# Altium schematic sheet CAN_Module.SchDoc
size 297 x 209 mm
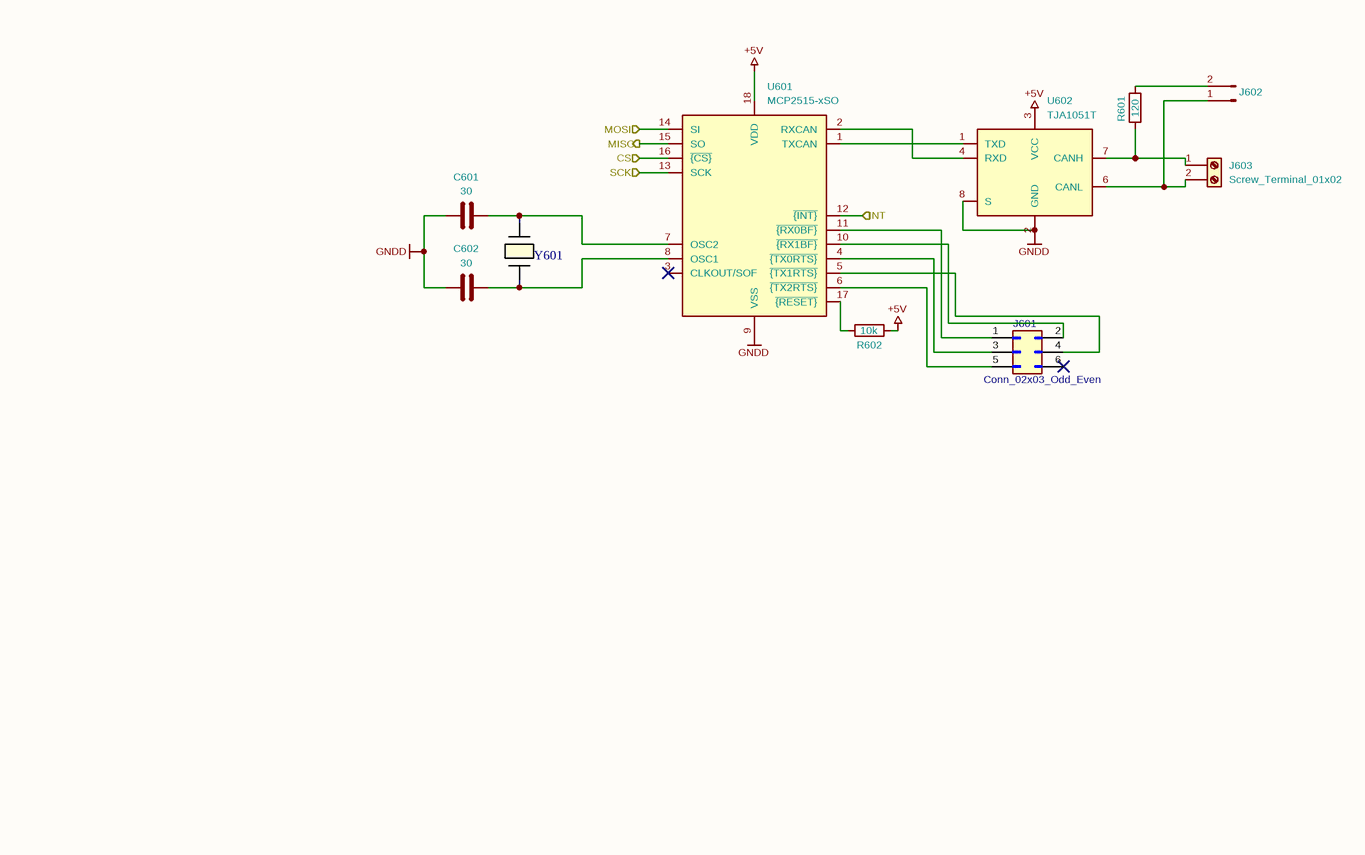
[diagram p0: CAN_Module.SchDoc]

## Parts
C601  30  [C_0402_1005Metric_Pad0.74x0.62mm_HandSolder]
C602  30  [C_0402_1005Metric_Pad0.74x0.62mm_HandSolder]
J601  Conn_02x03_Odd_Even  [PinHeader_2x03_P2.54mm_Vertical]
J602  Conn_01x02_Pin  [PinHeader_1x02_P2.54mm_Vertical]  (value not drawn)
J603  Screw_Terminal_01x02  [TerminalBlock_Xinya_XY308-2.54-2P_1x02_P2.54mm_Horizontal]
R601  120  [R_0603_1608Metric_Pad0.98x0.95mm_HandSolder]
R602  10k  [R_0603_1608Metric_Pad0.98x0.95mm_HandSolder]
U601  MCP2515-xSO  [SOIC-SO18_M]
U602  TJA1051T  [NXP-SOIC-8_M]
Y601  X49SM8MSD2SC  [H32_RAM]  (value not drawn)

## Ports
CS (in), INT (in), MISO (out), MOSI (in), SCK (in)

## Nets
+5V: R602.2 U601.18(VDD) U602.3(VCC)
GNDD: C601.1 C602.1 U601.9(VSS) U602.2(GND) U602.8(S)
CS: U601.16(~{{CS}}) ; port CS
INT: U601.12(~{{INT}}) ; port INT
MISO: U601.15(SO) ; port MISO
MOSI: U601.14(SI) ; port MOSI
SCK: U601.13(SCK) ; port SCK
NetC601_2: C601.2 U601.7(OSC2) Y601.1
NetC602_2: C602.2 U601.8(OSC1) Y601.2
NetJ601_1: J601.1(Pin_1) U601.11(~{{RX0BF}})
NetJ601_2: J601.2(Pin_2) U601.10(~{{RX1BF}})
NetJ601_3: J601.3(Pin_3) U601.4(~{{TX0RTS}})
NetJ601_4: J601.4(Pin_4) U601.5(~{{TX1RTS}})
NetJ601_5: J601.5(Pin_5) U601.6(~{{TX2RTS}})
NetJ602_1: J602.1(Pin_1) J603.2(Pin_2) U602.6(CANL)
NetJ602_2: J602.2(Pin_2) R601.1
NetJ603_1: J603.1(Pin_1) R601.2 U602.7(CANH)
NetR602_1: R602.1 U601.17(~{{RESET}})
NetU601_1: U601.1(TXCAN) U602.1(TXD)
NetU601_2: U601.2(RXCAN) U602.4(RXD)

Not connected (* = marked no-connect by the designer): J601 6(Pin_6)*; U601 3(CLKOUT/SOF)*; U602 5(NC)

## Notes on the sheet
- THIS DOCUMENT AND THE DATA DISCLOSED HEREIN OR
- HEREWITH IS THE PROPERTY OF TEAM HAYA OFF ROADING AND MAY
- NOT BE FREELY DISTRIBUTED IN WHOLE. ALL RIGHTS ARE
- RESERVED AND NO EXPRESS OR IMPLIED WARANTEE IS GIVEN.

## Library data of the parts
C601 C602 = C: Value: 30; Footprint: Capacitor_SMD:C_0402_1005Metric_Pad0.74x0.62mm_HandSolder
J601 = Conn_02x03_Odd_Even: Generic connector, double row, 02x03, odd/even pin numbering scheme (row 1 odd numbers, row 2 even numbers), script generated (kicad-library-utils/schlib/autogen/connector/); ki_fp_filters: Connector*:*_2x??_*; Value: Conn_02x03_Odd_Even; Datasheet: ~; Description_: Generic connector, double row, 02x03, odd/even pin numbering scheme (row 1 odd numbers, row 2 even numbers), script generated (kicad-library-utils/schlib/autogen/connector/); ki_keywords: connector
R601 R602 = R: Footprint: Resistor_SMD:R_0603_1608Metric_Pad0.98x0.95mm_HandSolder
  R601: Value: 120
  R602: Value: 10k
Y601 = HC49US-10.244MHZ-16PF-30-EXT-SMD-H32-TR: https://sharvielectronics.com/product/hc-49smd-8mhz-surface-mount-crystal-20pf-oscillator-x49sm8msd2sc/\; Mfr_Name: Rami Technology
J602 = Conn_01x02_Pin: Value: Conn_01x02_Pin
J603 = Screw_Terminal_01x02: Value: Screw_Terminal_01x02
U601 = MCP2515-xSO: Value: MCP2515-xSO; Footprint: Package_SO:SOIC-18W_7.5x11.6mm_P1.27mm
U602 = TJA1051T: Value: TJA1051T; Footprint: Package_SO:SOIC-8_3.9x4.9mm_P1.27mm